# EasyEDA Pro project macnano_power.epro

# Schematic Schematic1
Create Date: 2023-08-24; Page Name: P1; Project Name: macnano_power; Schematic Name: Schematic1; Update Date: 2023-09-18; Company: 嘉立创EDA; Page Size: A4; Version: V1.0
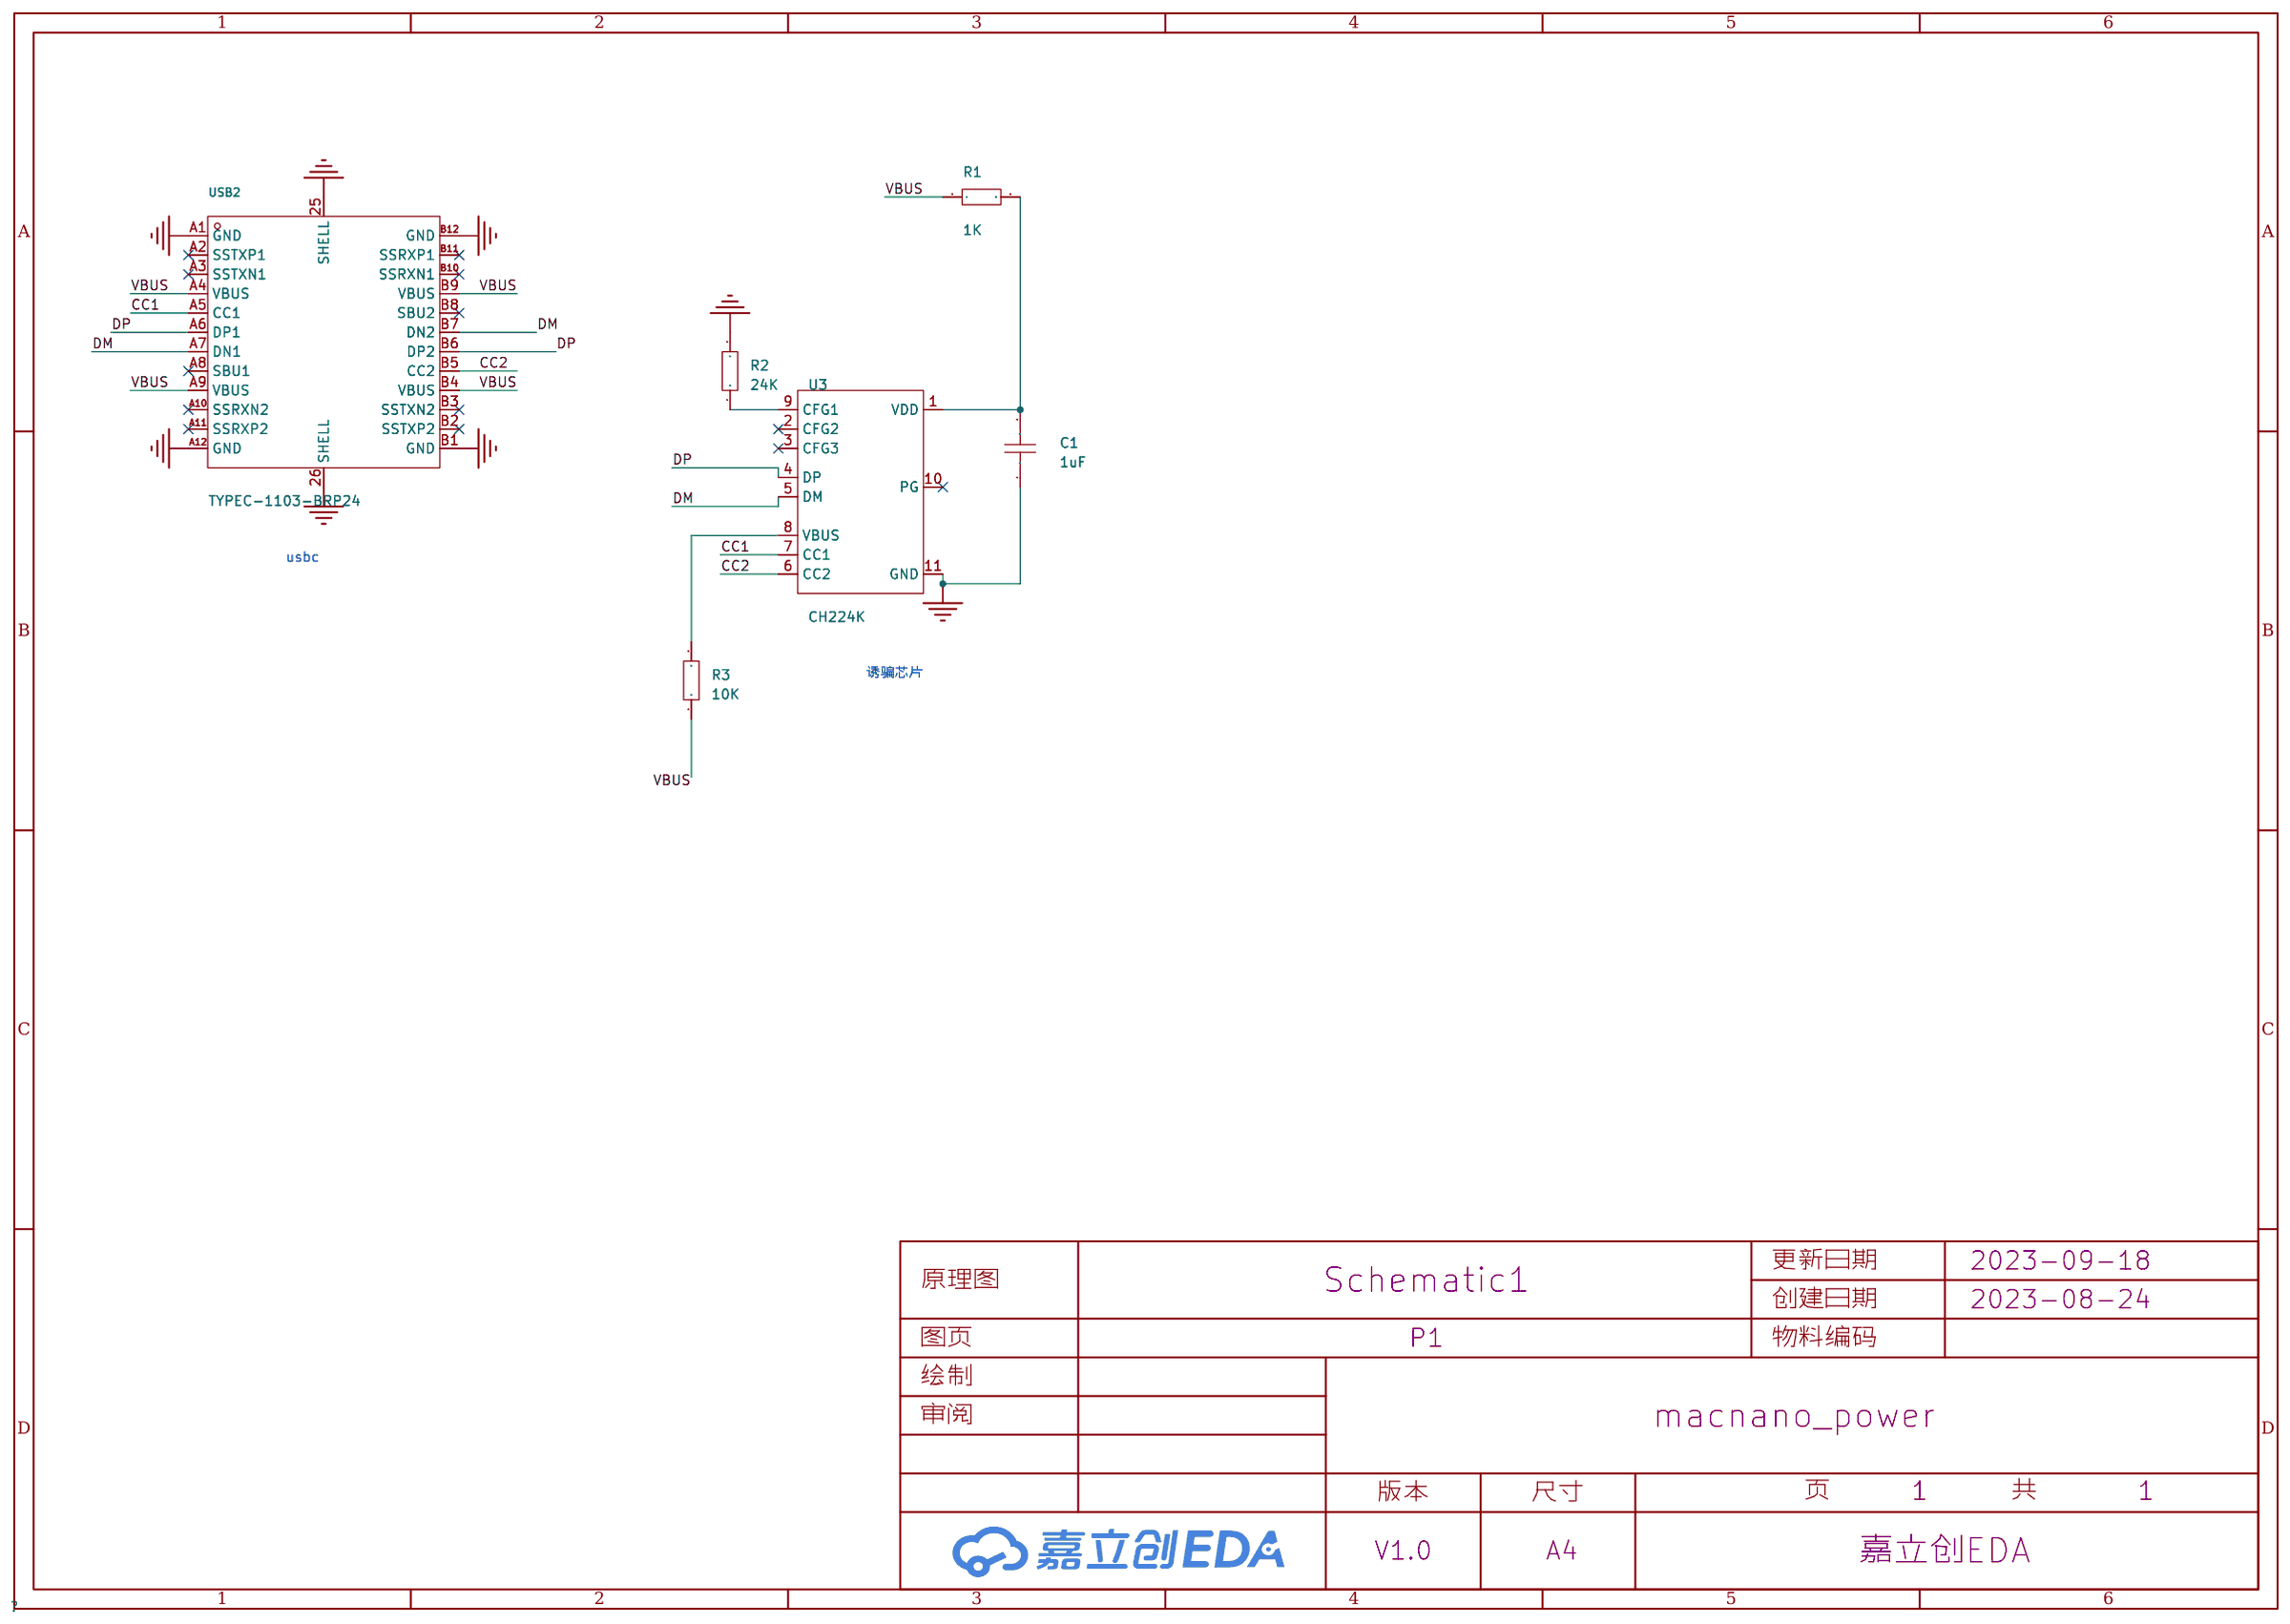
[diagram p0: schematic sheet]

## Parts
C1  1uF  [C0603]
R1  10K  [R0603]
R2  24K  [R0603]
R3  10K  [R0603]
U3  CH224K  [ESSOP-10_L4.9-W3.9-P1.0-LS6.0-TL-EP]
USB2  TYPEC-1103-BRP24  [USB-C-SMD_TYPEC-1103-BRP24]

## Library data of the parts
C1 = CAP_0603: Supplier Footprint: 0603
R1-R3 = Res_0603: Supplier Footprint: 0603
U3 = CH224K: Supplier Part: C970725; Manufacturer: WCH(南京沁恒); Supplier Footprint: ESSOP-10; JLCPCB Part Class: 扩展库; Datasheet: https://atta.szlcsc.com/upload/public/pdf/source/20220425/5F3B4646B9AC793D88468BCB08421765.pdf; Supplier: LCSC
USB2 = TYPEC-1103-BRP24: 连接器类型:Type-C;标准:USB 3.1;公母:母座;触点数量:24;端口数量:1;安装方式:夹板;额定电流 - 电源:5A;工作温度范围:-30℃~+85℃;焊接温度(最大值):260℃;; LCSC Part Name: Type-C 母座 夹板; Supplier Part: C2856665; Manufacturer: XUNPU(讯普); Supplier Footprint: SMD; Supplier: LCSC; Connector Type: Type-C; Standard: USB 3.1; Gender: 母座; Number of Contacts: 24; Number of Ports: 1; Mounting Style: 夹板; Current Rating - Power (Max): 5A; Operating Temperature Range: -30℃~+85℃; Welding Temperature (Max): 260℃

## Nets
GND: C1.1 R2.2 U3.11(GND) USB2.25(SHELL) USB2.26(SHELL) USB2.A1(GND) USB2.A12(GND) USB2.B1(GND) USB2.B12(GND)
VBUS: R1.1 R3.1 USB2.A4(VBUS) USB2.A9(VBUS) USB2.B4(VBUS) USB2.B9(VBUS)
CC1: U3.7(CC1) USB2.A5(CC1)
CC2: U3.6(CC2) USB2.B5(CC2)
DM: U3.5(DM) USB2.A7(DN1) USB2.B7(DN2)
DP: U3.4(DP) USB2.A6(DP1) USB2.B6(DP2)
$1N1754: R2.1 U3.9(CFG1)
$1N1863: R3.2 U3.8(VBUS)
$1N2024: C1.2 R1.2 U3.1(VDD)

Not connected (* = marked no-connect by the designer): U3 2(CFG2)* 3(CFG3)* 10(PG)*; USB2 A2(SSTXP1)* A3(SSTXN1)* A8(SBU1)* A10(SSRXN2)* A11(SSRXP2)* B2(SSTXP2)* B3(SSTXN2)* B8(SBU2)* B10(SSRXN1)* B11(SSRXP1)*

## Notes on the sheet
- usbc
- 诱骗芯片

# Board PCB2
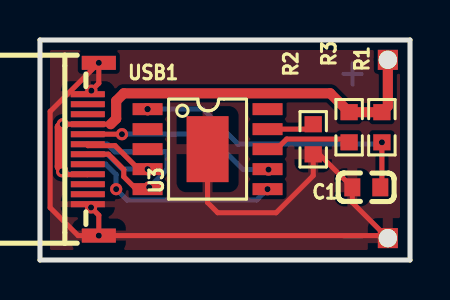
[diagram p1: board, top side]
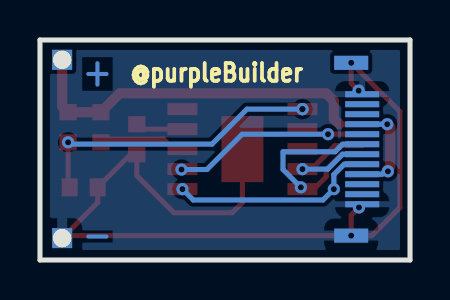
[diagram p2: board, bottom side, seen from below]

Outline 18.51 x 11 mm; copper layers: Top Layer, Bottom Layer. Coordinates in mm from the lower left corner of the outline.
Outline path: 0,11 0,0 18.51,0 18.51,11 0,11
Stack: Top Layer 0.035mm / Dielectric1 1.51mm FR4 er 4.5 / Bottom Layer 0.035mm

## Design rules (mm)
template: JLCPCB Capability(Two Layers Board)
spacing copperThickness1oz (default): track to track 0.102, other pairs 0.152 to 0.3
spacing copperThickness2oz: track to track 0.203, other pairs 0.152 to 0.3
track width copperThickness1oz (default): min 0.127, default 0.254, max 2.54
track width copperThickness2oz: min 0.203, default 0.254, max 2.54
differential pair differentialPair (default): width min 0.127, default 0.254, max 2.54; gap min 0.152, default 0.152
via viaSize (default): diameter min 0.5, default 0.61, max 10; hole min 0.3, default 0.305, max 6.3

## Placement (name value [footprint] x y rotation side)
C1  1uF  [C0603]  16.32 3.63 0 top
NOREF  -  [Pad_e981]  17.4 10.01 0 top
NOREF#2  -  [Pad_e567]  17.4 1.09 0 top
R1  10K  [R0603]  17.1 6.64 270 top
R2  24K  [R0603]  13.67 6.04 270 top
R3  10K  [R0603]  15.46 6.64 270 top
U3  CH224K  [ESSOP-10_L4.9-W3.9-P1.0-LS6.0-TL-EP]  8.38 5.54 270 top
USB1  TYPEC-1103-BRP24  [USB-C-SMD_TYPEC-1103-BRP24]  2.67 5.54 270 top

## Footprints (pads in the part's own frame, mm; a bottom-side part is the same pattern mirrored in y, then rotated)
C0603
  rect 0.8x0.9 smd: 1(-0.7,0) 2(0.7,0)
ESSOP-10_L4.9-W3.9-P1.0-LS6.0-TL-EP
  rect 0.6x1.5 smd: 1(-2,-3) 2(-1,-3) 3(0,-3) 4(1,-3) 5(2,-3) 6(2,3) 7(1,3) 8(0,3) 9(-1,3) 10(-2,3)
  rect 3.3x2.1 smd: 11(0,0)
Pad_e567
  rect 1x1 hole 0.914: 13(0,0)
Pad_e981
  rect 1x1 hole 0.914: 12(0,0)
R0603
  rect 0.806x0.864 smd: 1(-0.753,0) 2(0.753,0)
USB-C-SMD_TYPEC-1103-BRP24
  rect 0.7x1.7 smd: 25(-4.32,0.275) 25(4.32,0.275)
  rect 0.7x1.7 smd far side: 26(-4.32,0.275) 26(4.32,0.275)
  rect 0.3x1.7 smd: A1(-2.75,-0.275) A2(-2.25,-0.275) A3(-1.75,-0.275) A4(-1.25,-0.275) A5(-0.75,-0.275) A6(-0.25,-0.275) A7(0.25,-0.275) A8(0.75,-0.275) A9(1.25,-0.275) A10(1.75,-0.275) A11(2.25,-0.275) A12(2.75,-0.275)
  rect 0.3x1.7 smd far side: B1(2.75,-0.275) B2(2.25,-0.275) B3(1.75,-0.275) B4(1.25,-0.275) B5(0.75,-0.275) B6(0.25,-0.275) B7(-0.25,-0.275) B8(-0.75,-0.275) B9(-1.25,-0.275) B10(-1.75,-0.275) B11(-2.25,-0.275) B12(-2.75,-0.275)

## Nets
GND: C1.1 NOREF#2.13 R2.2 U3.11 USB1.25 USB1.26 USB1.A1 USB1.A12 USB1.B1 USB1.B12
VBUS: NOREF.12 R1.1 R3.1 USB1.A4 USB1.A9 USB1.B4 USB1.B9
CC1: U3.7 USB1.A5
CC2: U3.6 USB1.B5
DM: U3.5 USB1.A7 USB1.B7
DP: U3.4 USB1.A6 USB1.B6
$1N1754: R2.1 U3.9
$1N1863: R3.2 U3.8
$1N2024: C1.2 R1.2 U3.1

Pads without a net: U3 2 3 10; USB1 A2 A3 A8 A10 A11 B2 B3 B8 B10 B11

## Via types
v1: diameter 0.61, hole 0.305, Top Layer to Bottom Layer, 15 vias

## Routing (per net, layer and track width the routed paths; a pad name or vN(x,y) marks a point on that pad's centre or on a via; arc(x,y) is an arc through that point)
GND: length 45.1
  Top Layer w0.254: v1(2.94,1.22) 17.27,1.22 ; v1(2.94,1.22) 1.91,1.22 0.51,2.62 0.51,7.42 v1(2.94,9.86) 2.94,8.84 USB1.A1 ; v1(2.94,1.22) 2.94,2.24 USB1.A12 ; 17.27,1.22 15.62,2.87 C1.1 13.97,5.28 R2.2 13.67,4.22 11.81,2.36 8.89,2.36 8.38,2.87 U3.11 ; 17.27,1.22 NOREF#2.13
  vias: v1(2.57,8.47) v1(2.55,2.63)
VBUS: length 26.6
  Top Layer w0.254: v1(1.14,6.79) USB1.A4 3.54,6.79 ; 1.14,4.52 1.39,4.27 2.37,4.27 USB1.A9
  Top Layer w0.508: 1.14,4.52 0.99,4.67 0.99,6.64 v1(1.14,6.79) ; NOREF.12 17.4,7.69 R1.1 R3.1 14.52,8.33 4.19,8.33 3.81,7.95 3.81,7.06 3.54,6.79
  Bottom Layer w0.254: v1(1.1,4.43) 1.27,4.43 1.41,4.29 USB1.A9 ; v1(1.14,6.79) USB1.A4
CC1: length 9.8
  Top Layer w0.254: USB1.A5 v1(4.1,6.29) ; U3.7 11.41,4.54 v1(11.43,4.52)
  Bottom Layer w0.254: v1(11.43,4.52) 10.16,4.52 8.39,6.29 v1(4.1,6.29)
CC2: length 10.4
  Bottom Layer w0.254: v1(11.38,3.54) 10.84,3 4.35,3 v1(3.81,3.54) 3.81,4.27 3.29,4.79 USB1.B5
DM: length 10.2
  Top Layer w0.254: USB1.A7 3.43,5.29 4.19,4.52 4.19,4.16 4.72,3.63 v1(5.46,3.63)
  Bottom Layer w0.254: v1(5.46,3.63) 6.35,4.52 6.35,5.41 3.75,5.41 3.52,5.64 3.51,5.64 3.37,5.79 USB1.B7
DP: length 6.8
  Top Layer w0.254: USB1.A6 2.39,5.72 3.76,5.72 4.93,4.54 v1(5.38,4.54)
  Bottom Layer w0.254: USB1.B6 3.37,5.29 4.12,4.54 v1(5.38,4.54)
$1N1754: length 2.4
  Top Layer w0.254: R2.1 13.42,6.54 U3.9
$1N1863: length 4.4
  Top Layer w0.254: U3.8 11.83,5.54 12.34,6.05 15.3,6.05 R3.2
$1N2024: length 14.8
  Top Layer w0.254: C1.2 17.1,3.71 v1(17.1,5.88)
  Bottom Layer w0.254: v1(17.1,5.88) 17.01,5.79 9.91,5.79 8.16,7.54 v1(5.38,7.54)

## Copper pours and planes (outline as drawn; the poured copper is in the pictures)
GND on Top Layer: -0.89,12.14 19.56,12.14 19.56,-1.06 -0.89,-1.06
GND on Bottom Layer: -0.89,12.14 19.56,12.14 19.56,-0.94 -0.89,-0.94

## Text on the board
Bottom Layer: + | -
Bottom Silkscreen Layer: @purpleBuilder
